# EAGLE schematic old MainBoard 1.8.0 (EAGLE 9.6.2)
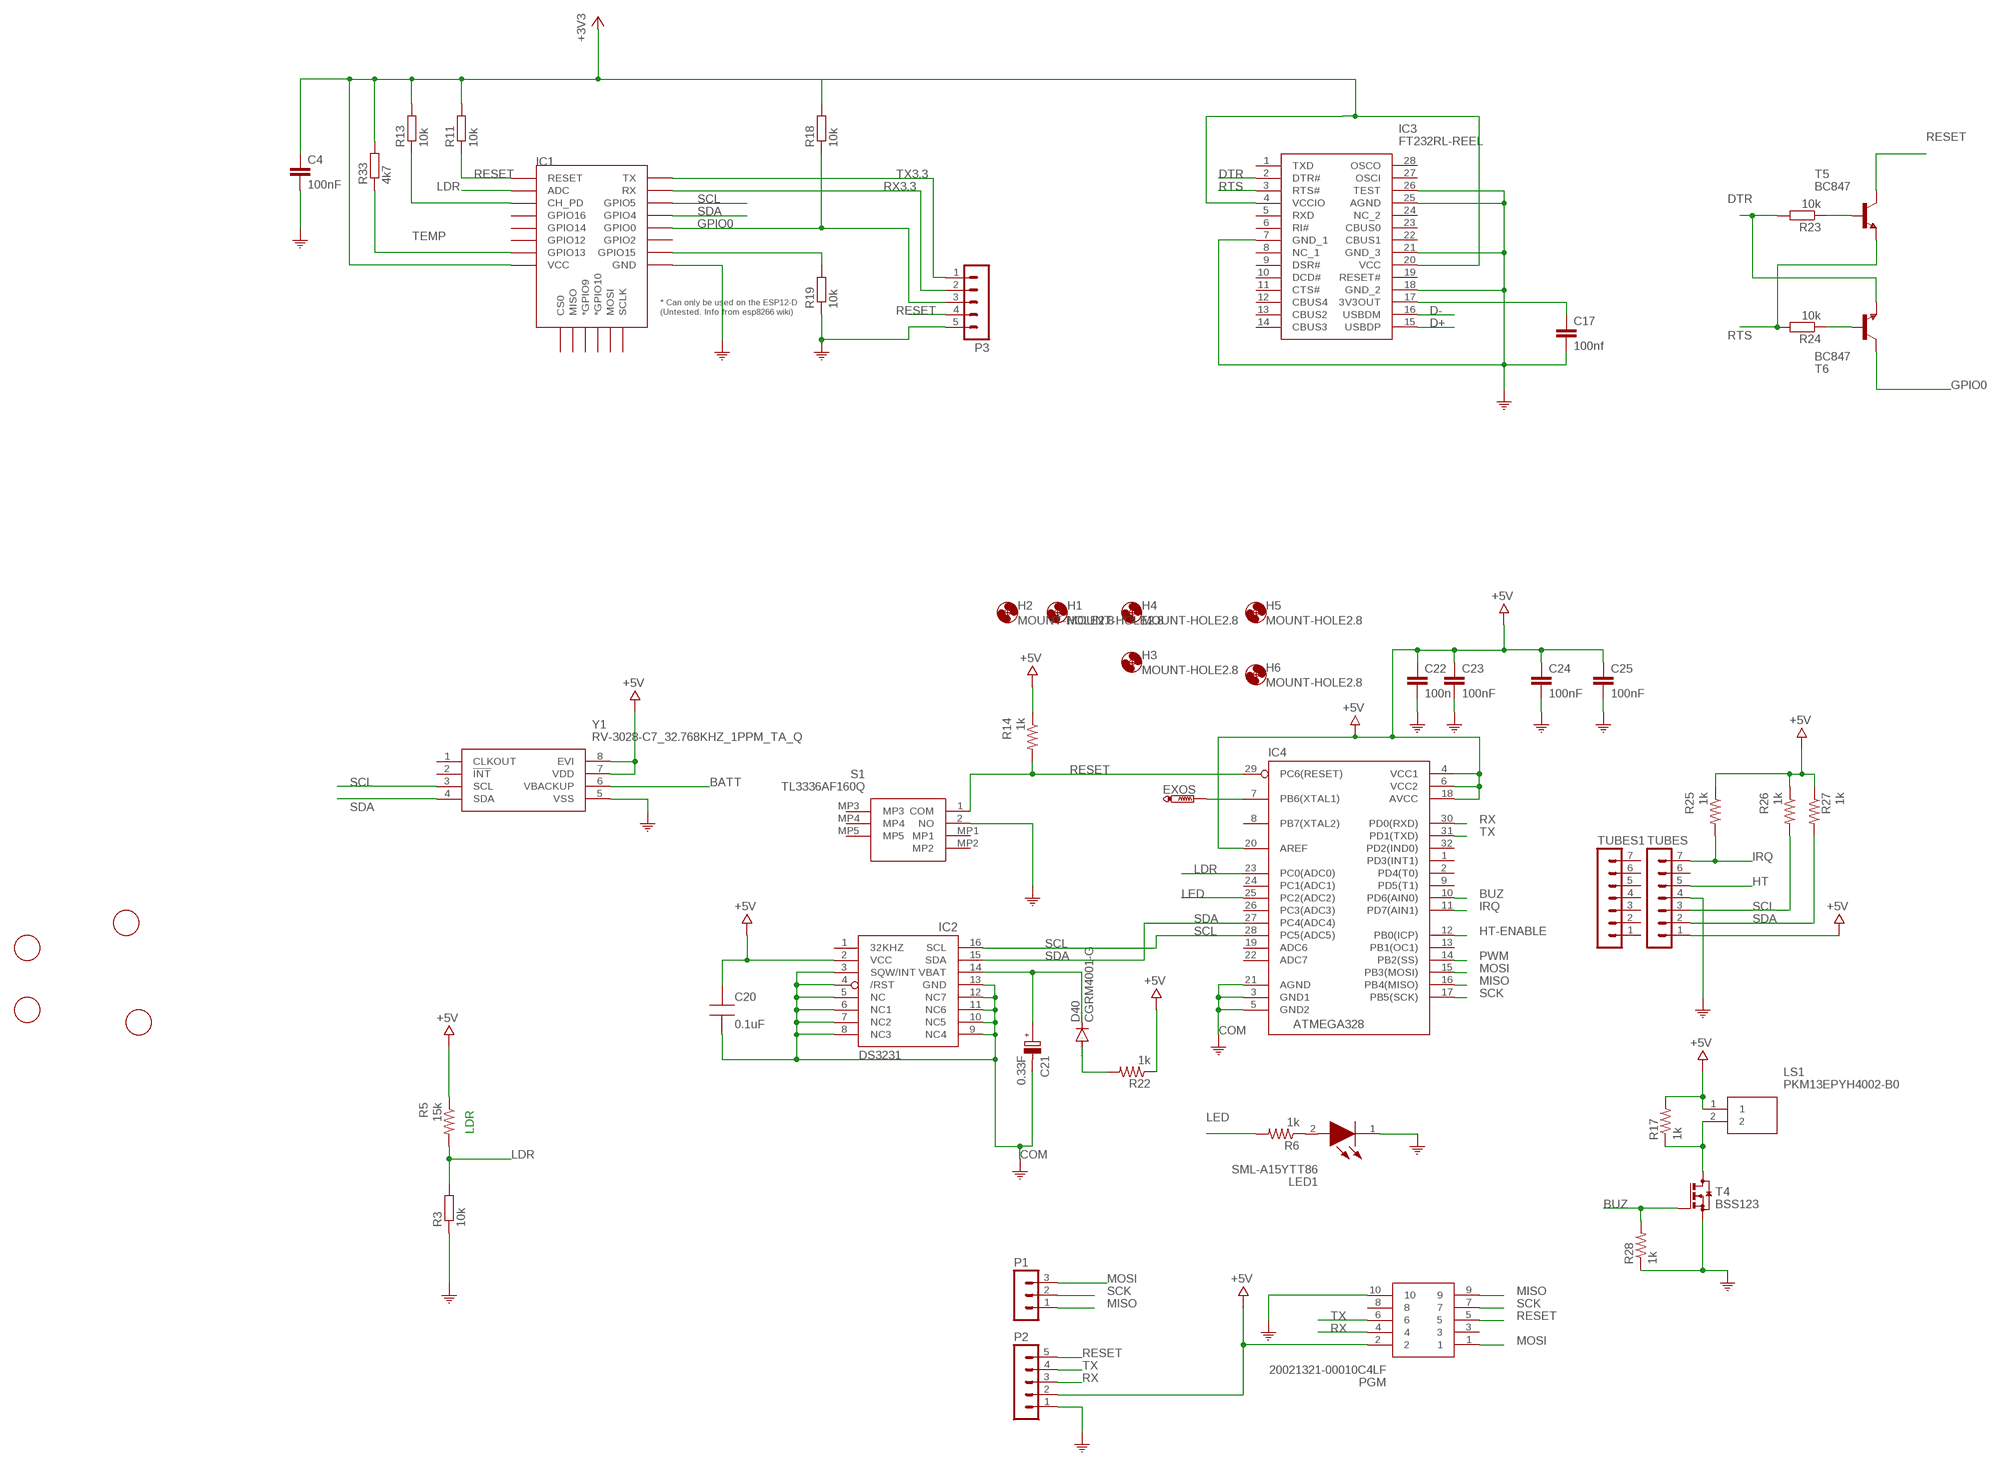
[diagram p0: schematic, sheet 1, part 1 of 2]
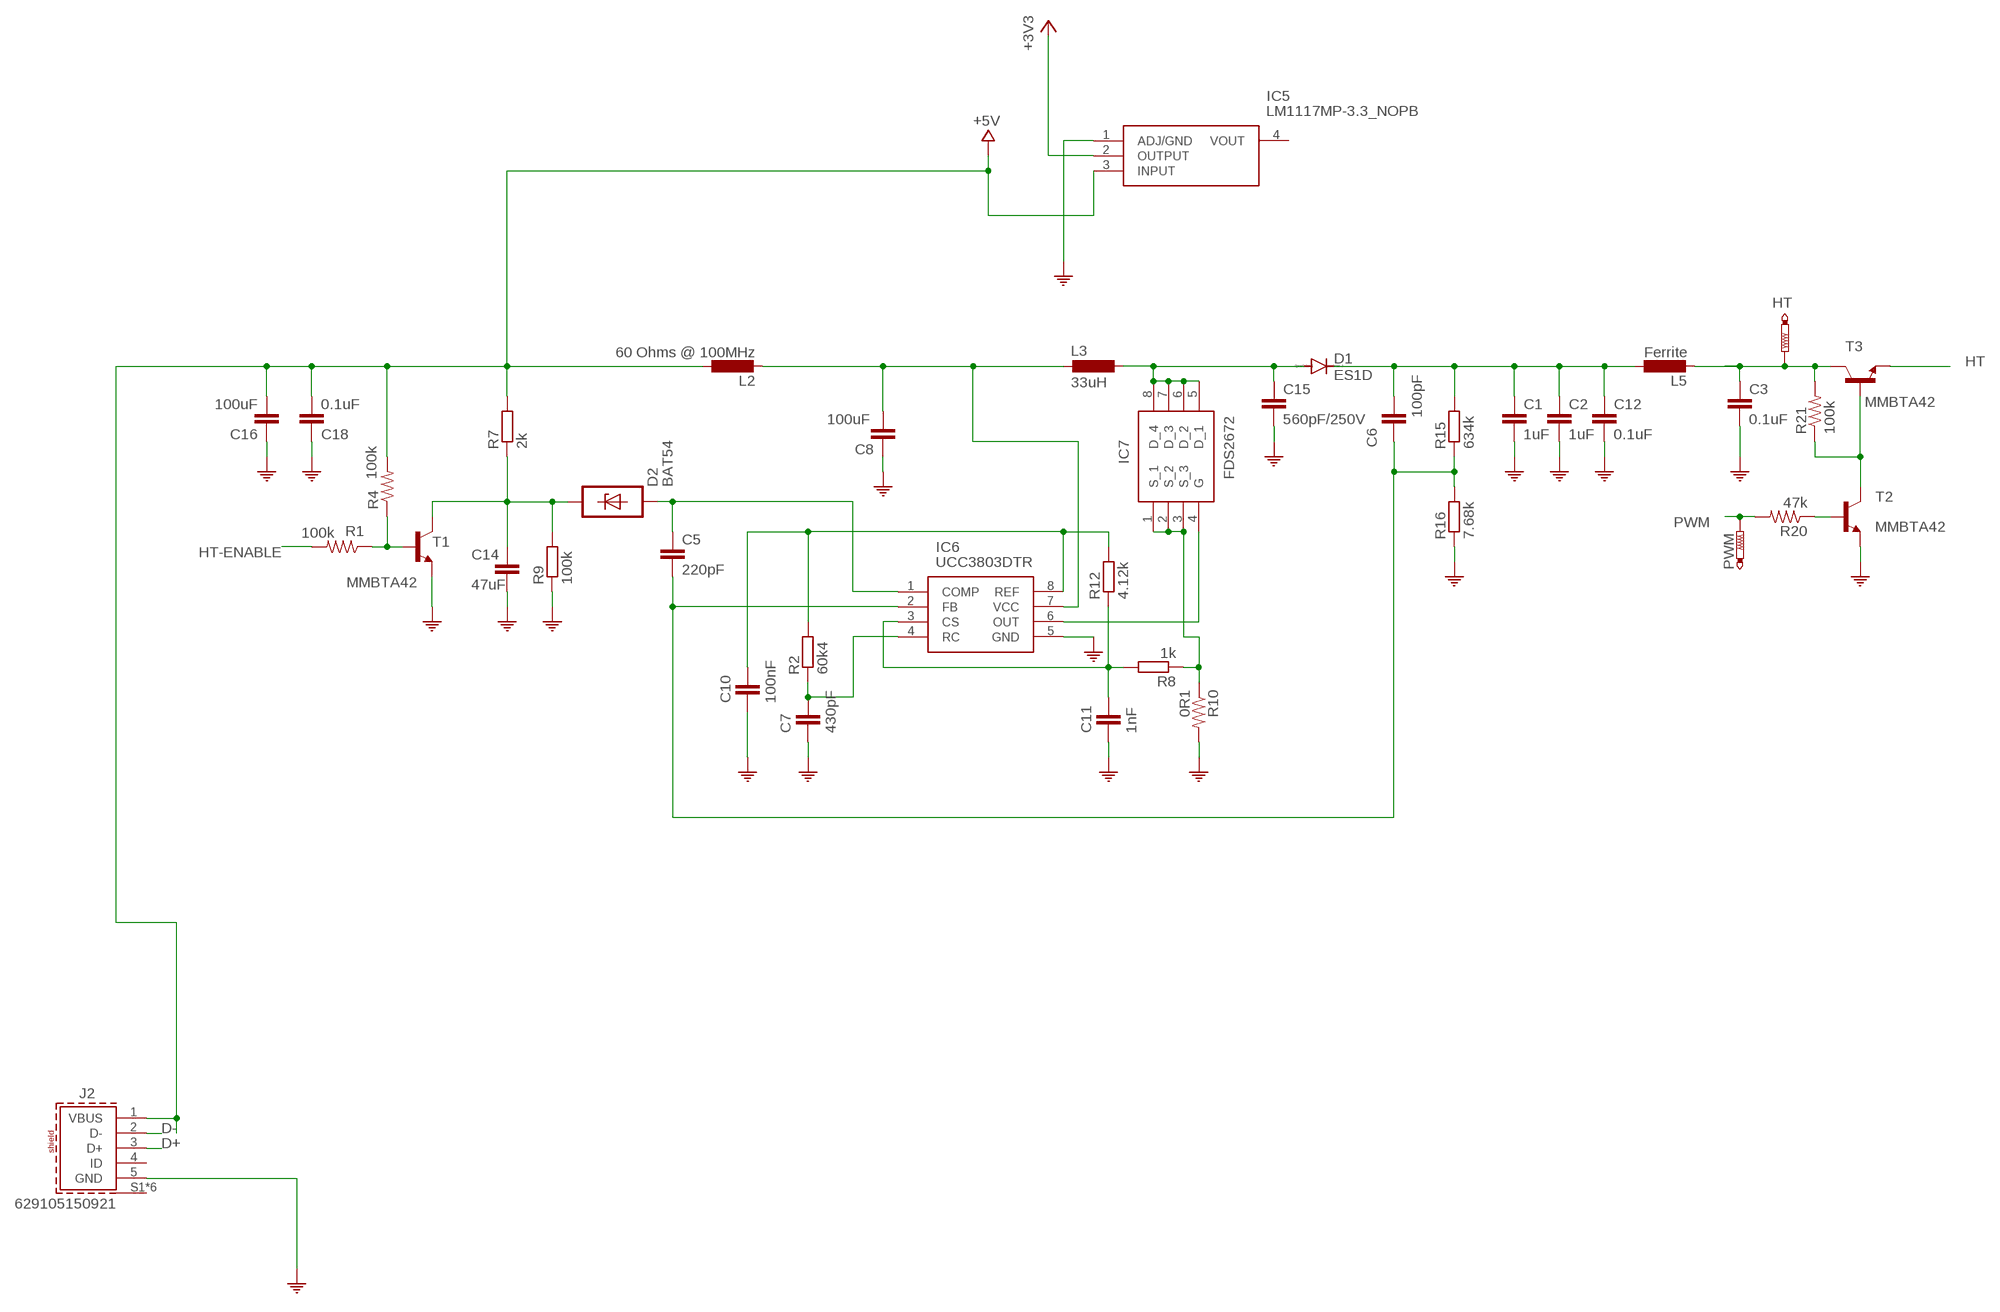
[diagram p1: schematic, sheet 1, part 2 of 2]

## Parts
C1  1uF  C-EUC1812K  [C1812K]
C2  1uF  C-EUC1812K  [C1812K]
C3  0.1uF  C-EUC1808  [C1808]
C4  100nF  C-EUC1812K  [C1812K]
C5  220pF  C-EUC0402  [C0402]
C6  100pF  C-EUC0805  [C0805]
C7  430pF  C-EUC0805  [C0805]
C8  100uF  C-EUC1210  [C1210]
C10  100nF  C-EUC0805  [C0805]
C11  1nF  C-EUC0805  [C0805]
C12  0.1uF  C-EUC1808  [C1808]
C14  47uF  C-EUC1210  [C1210]
C15  560pF/250V  C-EUC0603  [C0603]
C16  100uF  C-EUC1210  [C1210]
C17  100nf  C-EUC1206  [C1206]
C18  0.1uF  C-EUC0402  [C0402]
C20  0.1uF  CAP0805-NP  [CAP0805-NP]
C21  0.33F  AHG-35/100-RADIAL  [ELNA21.5X8.0]
C22  100n  C-EUC0805  [C0805]
C23  100nF  C-EUC0805  [C0805]
C24  100nF  C-EUC0805  [C0805]
C25  100nF  C-EUC0805  [C0805]
D1  ES1D  ES2D  [SMB]
D2  BAT54  SP4020-01FTG  [SOD323]
D40  CGRM4001-G  [SOD-123_MINI-SMA]
EXOS  PTR1TP09R  [TP09R]
H1  MOUNT-HOLE2.8  [2,8]
H2  MOUNT-HOLE2.8  [2,8]
H3  MOUNT-HOLE2.8  [2,8]
H4  MOUNT-HOLE2.8  [2,8]
H5  MOUNT-HOLE2.8  [2,8]
H6  MOUNT-HOLE2.8  [2,8]
HT  PTR1TP09R  [TP09R]
IC1  ESP12ESMD  [ESP12E-SMD]
IC2  DS3231/SO  [SO16W]
IC3  FT232RL-REEL  [SOP65P778X200-28N]
IC4  ATMEGA328  ATMEGA168-20AU  [QFP032]
IC5  LM1117MP-3.3_NOPB  [SOT230P700X180-4N]
IC6  UCC3803DTR  [SOIC127P600X175-8N]
IC7  FDS2672  [SOIC127P600X175-8N]
J2  629105150921  [629105150921]
L2  60 Ohms @ 100MHz  L-EUL2012C  [L2012C]
L3  33uH  MSS7341  [MSS7341]
L5  Ferrite  L-EUL2012C  [L2012C]
LED1  SML-A15YTT86  [SMLA15YTT86]
LS1  PKM13EPYH4002-B0  [PKM13EPYH4002-B0]
P1  MA03-1  [MA03-1]
P2  MA05-1  [MA05-1]
P3  MA05-1  [MA05-1]
PGM  20021321-00010C4LF  [2002132100010C4LF]
PWM  PTR1TP09R  [TP09R]
R1  100k  R-US_R0805  [R0805]
R2  60k4  R-EU_R0805  [R0805]
R3  10k  R-EU_0204/2V  [0204V]
R4  100k  R-US_R0805  [R0805]
R5  15k  R-US_M2012  [M2012]
R6  1k  R-US_M2012  [M2012]
R7  2k  R-EU_R0805  [R0805]
R8  1k  R-EU_R0805  [R0805]
R9  100k  R-EU_R0805  [R0805]
R10  0R1  R-US_R2010  [R2010]
R11  10k  R-EU_M0805  [M0805]
R12  4.12k  R-EU_R0805  [R0805]
R13  10k  R-EU_M0805  [M0805]
R14  1k  R-US_M2012  [M2012]
R15  634k  R-EU_R0805  [R0805]
R16  7.68k  R-EU_R0805  [R0805]
R17  1k  R-US_M2012  [M2012]
R18  10k  R-EU_M0805  [M0805]
R19  10k  R-EU_M0805  [M0805]
R20  47k  R-US_R0805  [R0805]
R21  100k  R-US_R0805  [R0805]
R22  1k  R-US_M2012  [M2012]
R23  10k  R-EU_M0805  [M0805]
R24  10k  R-EU_M0805  [M0805]
R25  1k  R-US_M2012  [M2012]
R26  1k  R-US_M2012  [M2012]
R27  1k  R-US_M2012  [M2012]
R28  1k  R-US_M2012  [M2012]
R33  4k7  R-EU_M0805  [M0805]
S1  TL3336AF160Q  [TL3336AF160Q]
T1  MMBTA42  BC846  [SOT23]
T2  MMBTA42  BC846  [SOT23]
T3  MMBTA42  BC846  [SOT23]
T4  BSS123  [SOT23]
T5  BC847  [SOT23]
T6  BC847  [SOT23]
TUBES  MA07-1  [MA07-1]
TUBES1  MA07-1  [MA07-1]
U$4  FIDUCIAL  [FIDUCIAL_1MM]
U$5  FIDUCIAL  [FIDUCIAL_1MM]
U$20  FIDUCIAL  [FIDUCIAL_1MM]
U$36  FIDUCIAL  [FIDUCIAL_1MM]
Y1  RV-3028-C7_32.768KHZ_1PPM_TA_Q  [RV3028C732768KHZ1PPMTAQC]

## Nets
+3V3: C4.1 IC1.VCC IC3.4(VCCIO) IC3.20(VCC) IC5.2(OUTPUT) R11.2 R13.2 R18.2 R33.2
+5V [pwr]: C16.2 C18.1 C20.1 C22.1 C23.1 C24.1 C25.1 IC2.2(VCC) IC4.4(VCC1) IC4.6(VCC2) IC4.18(AVCC) IC4.20(AREF) IC5.3(INPUT) J2.1(VBUS) L2.1 LS1.1 P2.2 PGM.2 R4.2 R5.1 R7.2 R14.1 R17.2 R22.1 R25.1 R26.1 R27.1 TUBES.1 Y1.7(VDD) Y1.8(EVI)
BATT: C21.+ D40.C IC2.14(VBAT) Y1.6(VBACKUP)
BUZ: IC4.10(PD6(AIN0)) R28.2 T4.1(G)
COM: C1.2 C2.2 C3.2 C4.2 C7.2 C8.1 C10.2 C11.2 C12.2 C14.2 C15.2 C16.1 C17.2 C18.2 C20.2 C21.- C22.2 C23.2 C24.2 C25.2 IC1.GND IC2.3(SQW/INT) IC2.4(/RST) IC2.5(NC) IC2.6(NC1) IC2.7(NC2) IC2.8(NC3) IC2.9(NC4) IC2.10(NC5) IC2.11(NC6) IC2.12(NC7) IC2.13(GND) IC3.7(GND_1) IC3.18(GND_2) IC3.21(GND_3) IC3.25(AGND) IC3.26(TEST) IC4.3(GND1) IC4.5(GND2) IC4.21(AGND) IC5.1(ADJ/GND) IC6.5(GND) J2.5(GND) LED1.1(K) P2.1 P3.5 PGM.10 R3.1 R9.1 R10.2 R16.1 R19.1 R28.1 S1.2(NO) T1.2(E) T2.2(E) T4.2(S) TUBES.4 Y1.5(VSS)
CS: C11.1 IC6.3(CS) R8.2 R12.1
D+: IC3.15(USBDP) J2.3(D+)
D-: IC3.16(USBDM) J2.2(D-)
DTR: IC3.2(DTR#) R23.2 T6.2(E)
FB: C5.2 C6.2 IC6.2(FB) R15.1 R16.2
GPIO0: IC1.GPIO0 P3.3 R18.1 T6.3(C)
HT: T3.2(E) TUBES.5
HT-ENABLE: IC4.12(PB0(ICP)) R1.2
IRQ: IC4.11(PD7(AIN1)) R25.2 TUBES.7
LDR: IC1.ADC IC4.23(PC0(ADC0)) R3.2 R5.2
LED: IC4.25(PC2(ADC2)) R6.2
MISO: IC4.16(PB4(MISO)) P1.1 PGM.9
MOSI: IC4.15(PB3(MOSI)) P1.3 PGM.1
N$1: LED1.2(A) R6.1
N$2: IC1.CH_PD R13.1
N$3: LS1.2 R17.1 T4.3(D)
N$5: EXOS.TP IC4.7(PB6(XTAL1))
N$6: C1.1 C2.1 C6.1 C12.1 D1.C L5.1 R15.2
N$7: R21.1 T2.3(C) T3.1(B)
N$8: R1.1 R4.1 T1.1(B)
N$9: C14.1 D2.C R7.1 R9.2 T1.3(C)
N$10: C5.1 D2.A IC6.1(COMP)
N$11: IC1.GPIO15 R19.2
N$12: IC7.1(S_1) IC7.2(S_2) IC7.3(S_3) R8.1 R10.1
N$13: R23.1 T5.1(B)
N$14: C8.2 IC6.7(VCC) L2.2 L3.1
N$15: R24.1 T6.1(B)
N$16: C17.1 IC3.17(3V3OUT)
N$18: C15.1 D1.A IC7.5(D_1) IC7.6(D_2) IC7.7(D_3) IC7.8(D_4) L3.2
N$19: R20.1 T2.1(B)
N$23: D40.A R22.2
OUT: IC6.6(OUT) IC7.4(G)
PWM: IC4.14(PB2(SS)) PWM.TP R20.2
RAW_HT: C3.1 HT.TP L5.2 R21.2 T3.3(C)
RC: C7.1 IC6.4(RC) R2.1
REF: C10.1 IC6.8(REF) R2.2 R12.2
RESET: IC1.RESET IC4.29(PC6(RESET)) P2.5 P3.4 PGM.5 R11.1 R14.2 S1.1(COM) T5.3(C)
RTS: IC3.3(RTS#) R24.2 T5.2(E)
RX: IC4.30(PD0(RXD)) P2.3 PGM.4
RX3.3: IC1.RXD0(RX) P3.2
SCK: IC4.17(PB5(SCK)) P1.2 PGM.7
SCL: IC1.GPIO5 IC2.16(SCL) IC4.28(PC5(ADC5)) R26.2 TUBES.3 Y1.3(SCL)
SDA: IC1.GPIO4 IC2.15(SDA) IC4.27(PC4(ADC4)) R27.2 TUBES.2 Y1.4(SDA)
TEMP: IC1.GPIO13 R33.1
TX: IC4.31(PD1(TXD)) P2.4 PGM.6
TX3.3: IC1.TXD0(TX) P3.1
Unconnected: IC1.CS0 IC1.GPIO2 IC1.GPIO9(*GPIO9) IC1.GPIO10(*GPIO10) IC1.GPIO12 IC1.GPIO14 IC1.GPIO16 IC1.MISO IC1.MOSI IC1.SCLK IC2.1(32KHZ) IC3.1(TXD) IC3.5(RXD) IC3.6(RI#) IC3.8(NC_1) IC3.9(DSR#) IC3.10(DCD#) IC3.11(CTS#) IC3.12(CBUS4) IC3.13(CBUS2) IC3.14(CBUS3) IC3.19(RESET#) IC3.22(CBUS1) IC3.23(CBUS0) IC3.24(NC_2) IC3.27(OSCI) IC3.28(OSCO) IC4.1(PD3(INT1)) IC4.2(PD4(T0)) IC4.8(PB7(XTAL2)) IC4.9(PD5(T1)) IC4.13(PB1(OC1)) IC4.19(ADC6) IC4.22(ADC7) IC4.24(PC1(ADC1)) IC4.26(PC3(ADC3)) IC4.32(PD2(IND0)) IC5.4(VOUT) J2.4(ID) J2.S1(SHIELD) J2.S2(SHIELD) J2.S3(SHIELD) J2.S4(SHIELD) J2.S5(SHIELD) J2.S6(SHIELD) PGM.3 PGM.8 S1.MP1 S1.MP2 S1.MP3 S1.MP4 S1.MP5 TUBES1.1 TUBES1.2 TUBES1.3 TUBES1.4 TUBES1.5 TUBES1.6 TUBES1.7 TUBES.6 Y1.1(CLKOUT) Y1.2(!INT)

## Notes on the sheet
- LDR

## Library data of the parts
C1 C2 = rcl:C-EU: CAPACITOR, European symbol; MOUSER: 810-CGA8P3X7T2E105MA; PU: 1.07; SPICEPREFIX: C; TDK: C4532X7T2E105M250KE
C3 C12 = rcl:C-EU: CAPACITOR, European symbol; MOUSER: 581-1808PC104KAT1A; PU: 0.88; SPICEPREFIX: C
C4 C17 = resistor:C-EU: CAPACITOR, European symbol
C5 = rcl:C-EU: CAPACITOR, European symbol; MOUSER: 963-LMK042B7221KC-W; SPICEPREFIX: C
C6 = rcl:C-EU: CAPACITOR, European symbol; MOUSER: 81-GCM21A5C2E101JX1D; PU: 0.319; SPICEPREFIX: C
C7 = rcl:C-EU: CAPACITOR, European symbol; MOUSER: 581-08055A431JAT4A; PU: 0.23; SPICEPREFIX: C
C8 C16 = rcl:C-EU: CAPACITOR, European symbol; MOUSER: 963-EMK325ABJ107MM-P; SPICEPREFIX: C; TAIYO_YUDEN: EMK325ABJ107MM-P
C10 = rcl:C-EU: CAPACITOR, European symbol; MOUSER: 963-EMF212B7104KGHT; PU: 0.23; SPICEPREFIX: C
C11 = rcl:C-EU: CAPACITOR, European symbol; MOUSER: 710-885382207004; PU: 0.122; SPICEPREFIX: C
C14 = rcl:C-EU: CAPACITOR, European symbol; MOUSER: 963-EMK325BJ476MM-P; SPICEPREFIX: C
C15 = rcl:C-EU: CAPACITOR, European symbol; MOUSER: 80-C0603C561JAG; PU: 0.038; SPICEPREFIX: C
C18 = rcl:C-EU: CAPACITOR, European symbol; MOUSER: 963-LMF105B7104KVHF; PU: 0.676; SPICEPREFIX: C
C20 = MySMD:CAP0805-NP
C21 = Elkos:AHG-35/100-RADIAL: AUDYN® - AHG Gepolt, radial High Grade AHG Gepolter Elekrolytkondensator für Audio-Netzteile, oder Verstärker im Home- und Car-Bereich. Technische Daten Anschlußdrähte: Kupfer, verzinnt AL: ? mm d2ø : ? mm Kapazitätsbereich: von 10 µF bis 2200 µF Nennspannungen: 25 V, 35 V, 50 V, 100 V C-Toleranz: 20 % ( bei 20° C ) Verlustfaktor: tan δ < 0,100 @ 1 kHz Temperaturbereich: - 40° C bis 85° C Verzerrung: sehr gering bei 10 kHz, 010 A - 120 dB oder niedriger gepolt AHG AUDYN® - AHG gepolt Bezeichnung C U DxH Rm Bestell.-Nr. U / Volt D x L/mm mm AHG/10.0/100V 10µF 100V 10x15 5,0 1341690 AHG/22.0/50V 22µF 50V 10x13 5,0 1341691 AHG/47.0/50V 47µF 50V 10x16 5,0 1341692 AHG/100.0/50V 100µF 50V 13x21 5,0 1341693 AHG/220.0/50V 220µF 50V 16x25 7,5 1341694 AHG/470.0/50V 470µF 50V 16x37 7,5 1341695 AHG/1000/35V 1000µF 35V 18x37 7,5 1341696 AHG/2200/35V 2200µF 35V 22x38 10,0 1341697 Alle Abmessungen in mm; MOUSER: 555-DBN-5R5D334T; PU: 2.46
C22-C25 = rcl:C-EU: CAPACITOR, European symbol; SPICEPREFIX: C
D1 = diode:ES2D: DIODE super fast rectifier, 2 A; MOUSER: 512-ES1DF
D2 = sp4020_11:SP4020-01FTG: SP4020 Series 2.5pF, 30A Discrete TVS Diode Source: http://www.littelfuse.com/~/media/electronics/datasheets/tvs_diode_arrays/littelfuse_tvs_diode_array_sp4020_datasheet.pdf.pdf; MF: Littelfuse; MOUSER: 621-BAT54WS-F; MPN: SP4020-01FTG; OC_FARNELL: unknown; OC_NEWARK: 05X0400
D40 = diode:CGRM400*-G: Molded plasitc,JEDEC SOD-123/Mini SMA Source: Comchip CGRM4001-G.pdf; MOUSER: 863-NSR0320MW2T1G; PU: 0.22
EXOS HT PWM = testpad:PTR1: TEST PIN
H1-H6 = holes:MOUNT-HOLE: MOUNTING HOLE with drill center marker
IC1 = esp8266modules:ESP12E: ESP12E Module
IC2 = DS3231:DS3231; AVAILABILITY: Unavailable; MF: Maxim Integrated; MOUSER: 700-DS3231SN#; MP: DS3231; PACKAGE: SOIC-16 Maxim Integrated; PRICE: None; PU: 9.50
IC3 = SamacSys_Parts:FT232RL-REEL: USB/Serial IC UART SSOP-28 FTDI Chip FT232RL-REEL, USB Controller, 3MBd, USB 2.0, 1.8 5.25 V, 28-Pin SSOP Source: Datasheet <http://www.ftdichip.com/Support/Documents/DataSheets/ICs/DS_FT232R.pdf>; DESCRIPTION: USB/Serial IC UART SSOP-28 FTDI Chip FT232RL-REEL, USB Controller, 3MBd, USB 2.0, 1.8 5.25 V, 28-Pin SSOP; HEIGHT: 2mm; MANUFACTURER_NAME: FTDI Chip; MANUFACTURER_PART_NUMBER: FT232RL-REEL; MOUSER_PART_NUMBER: 895-FT232RL; MOUSER_PRICE-STOCK: https://www.mouser.co.uk/ProductDetail/FTDI/FT232RL-REEL?qs=D1%2FPMqvA103RC6OU6bKtoA%3D%3D
IC4 = MySMD:ATMEGA168-20AU; PU: 1.40
IC5 = SamacSys_Parts:LM1117MP-3.3_NOPB: Space saving 800-mA low-dropout linear regulator with internal current limit Source: Datasheet <http://www.ti.com/general/docs/suppproductinfo.tsp?distId=10&gotoUrl=http://www.ti.com/lit/gpn/lm1117>; DESCRIPTION: Space saving 800-mA low-dropout linear regulator with internal current limit; HEIGHT: 1.8mm; MANUFACTURER_NAME: Texas Instruments; MANUFACTURER_PART_NUMBER: LM1117MP-3.3/NOPB; MOUSER_PART_NUMBER: 926-LM1117MP-3.3NOPB; MOUSER_PRICE-STOCK: https://www.mouser.co.uk/ProductDetail/Texas-Instruments/LM1117MP-33-NOPB?qs=X1J7HmVL2ZFn4x9DZ4T2hA%3D%3D
IC6 = UCC3803DTR:UCC3803DTR: Switching Controllers Low-Power BiCMOS Current-Mode PWM Source: Datasheet <http://www.ti.com/lit/ds/symlink/ucc3803.pdf>; DESCRIPTION: Switching Controllers Low-Power BiCMOS Current-Mode PWM; HEIGHT: 1.75mm; MANUFACTURER_NAME: Texas Instruments; MANUFACTURER_PART_NUMBER: UCC3803DTR; MOUSER: 595-UCC3803D; MOUSER_PART_NUMBER: 595-UCC3803DTR; MOUSER_PRICE-STOCK: https://www.mouser.com/Search/Refine.aspx?Keyword=595-UCC3803DTR; PU: 3.05
IC7 = FDS2672:FDS2672: FDS2672, N-channel MOSFET Transistor 3.9 A 200 V, 8-Pin SOIC Source: Datasheet <http://docs-emea.rs-online.com/webdocs/0d23/0900766b80d23481.pdf>; DESCRIPTION: FDS2672, N-channel MOSFET Transistor 3.9 A 200 V, 8-Pin SOIC; HEIGHT: 1.75mm; MANUFACTURER_NAME: Fairchild Semiconductor; MANUFACTURER_PART_NUMBER: FDS2672; MOUSER: 512-FDS2672; MOUSER_PART_NUMBER: 512-FDS2672; MOUSER_PRICE-STOCK: https://www.mouser.com/Search/Refine.aspx?Keyword=512-FDS2672; PU: 1.54; RS_PART_NUMBER: 6710481P; RS_PRICE-STOCK: http://uk.rs-online.com/web/p/products/6710481P
J2 = Wurth_Connectors_WR-USB:629105150921: WR-COM Micro USB 2.0 Type AB Horizontal Kind Properties Durability:10 000 Mating cycles Connector Type:Micro USB Gender:Receptacle Type:Horizontal General Information Operating Temperature:-40up to +85 °C Electrical Properties Working Voltage:30V (AC) Withstanding Voltage:100V (AC) Contact Resistance:30 mΩ Material Properties Insulator Material:LCP Insulator Flammability Rating:UL94 V-0 Color:Black Contact Material:Copper Alloy Contact Plating: Gold Contact Type:Stamped Shielding Material:Stainless Steel Shielding Plating:Matte Tin <https://www.we-online.com/catalog/media/o33046v209%20Family_WR-COM_Micro_USB_629105150921.jpg> Details see: https://www.we-online.com/catalog/en/COM_MICRO_2_0_TYPE_AB_HORIZONTAL/ Updated by Ella Wu 2021-03-09 2021 (C) Würth Elektronik; APPLICATION: Micro USB 2.0; DATASHEET-URL: https://www.we-online.com/catalog/datasheet/629105150921.pdf; GERDER: Receptacle; INTERFACE-TYPE: Type AB; IR1: 1.8A; MOUNT: SMT; MOUSER: 710-629105150921; PACKAGING: Tape and Reel; PART-NUMBER: 629105150921; PINS: 5; PU: 1.90; TYPE: Horizontal; WORKING-VOLTAGE: 30V(AC)
L2 L5 = rcl:L-EU: INDUCTOR, European symbol; MOUSER: 963-BKP2125HS600-T; SPICEPREFIX: L
L3 = STEAM-inductor-coilcraft:MSS7341: Shielded Power Inductors Package 6.6 × 6.6 mm x 4.1 mm high Source: http://www.farnell.com/datasheets/1681958.pdf; MOUSER: 710-784770330; PU: 2.55
LED1 = SamacSys_Parts:SML-A15YTT86: Yellow 590nm LED Indication - Discrete 2.1V 2-SMD, No Lead Source: Datasheet <https://fscdn.rohm.com/en/products/databook/datasheet/opto/led/chip_mono/sml-a15x-e.pdf>; DESCRIPTION: Yellow 590nm LED Indication - Discrete 2.1V 2-SMD, No Lead; HEIGHT: 0.65mm; MANUFACTURER_NAME: ROHM Semiconductor; MANUFACTURER_PART_NUMBER: SML-A15YTT86; MOUSER: 755-SML-A15YTT86; PU: 0.25
LS1 = SamacSys_Parts:PKM13EPYH4002-B0: Transducer piezo PCB 30Vpp 70dB 12.6mm Murata Buzzer Source: Datasheet <http://www.murata.com/~/media/webrenewal/support/library/catalog/products/sound/p37e.ashx>; DESCRIPTION: Transducer piezo PCB 30Vpp 70dB 12.6mm Murata Buzzer; HEIGHT: mm; MANUFACTURER_NAME: Murata Electronics; MANUFACTURER_PART_NUMBER: PKM13EPYH4002-B0; MOUSER_PART_NUMBER: 81-PKM13EPYH4002-B0; MOUSER_PRICE-STOCK: https://www.mouser.co.uk/ProductDetail/Murata-Electronics/PKM13EPYH4002-B0?qs=flZjIlU0hx09jX8FupUNIw%3D%3D
P1 = con-lstb:MA03-1: PIN HEADER; OC_FARNELL: unknown; OC_NEWARK: unknown
P2 P3 = con-lstb:MA05-1: PIN HEADER; OC_FARNELL: unknown; OC_NEWARK: unknown
PGM = SamacSys_Parts:20021321-00010C4LF: Headers & Wire Housings 1.27x1.27mm BTB, Hdr Recept, SMT, 10 Pos Source: Datasheet <https://componentsearchengine.com/Datasheets/1/20021321-00010C4LF.pdf>; DESCRIPTION: Headers & Wire Housings 1.27x1.27mm BTB, Hdr Recept, SMT, 10 Pos; HEIGHT: 4.75mm; MANUFACTURER_NAME: Amphenol; MANUFACTURER_PART_NUMBER: 20021321-00010C4LF; MOUSER_PART_NUMBER: 649-202132100010C4LF; MOUSER_PRICE-STOCK: https://www.mouser.com/Search/Refine.aspx?Keyword=649-202132100010C4LF
R1 R4-R6 R14 R17 R20-R22 R25-R28 = adafruit:R-US_: RESISTOR, American symbol
R2 = rcl:R-EU_: RESISTOR, European symbol; MOUSER: 603-RT0805FRE0760K4L; PU: 0.11; SPICEPREFIX: R
R3 R8 R9 = rcl:R-EU_: RESISTOR, European symbol; SPICEPREFIX: R
R7 = rcl:R-EU_: RESISTOR, European symbol; MOUSER: 754-RR1220P-202D; SPICEPREFIX: R; SUSUMU: RR1220P-202-D
R10 = adafruit:R-US_: RESISTOR, American symbol; MOUSER: 603-PE2010FKE070R1L; PU: 0.7
R11 R13 R18 R19 R23 R24 R33 = resistor:R-EU_: RESISTOR, European symbol
R12 = rcl:R-EU_: RESISTOR, European symbol; KOASPEER: RN732ATTD4121F100; MOUSER: 660-RN732ATD4121F100; SPICEPREFIX: R
R15 = rcl:R-EU_: RESISTOR, European symbol; MOUSER: 71-CRCW0603-634K-E3; SPICEPREFIX: R; VISHAY: CRCW0603634KFKEA
R16 = rcl:R-EU_: RESISTOR, European symbol; MOUSER: 71-CRCW0805-7.68K-E3; PU: 0.09; SPICEPREFIX: R; VISHAY: CRCW08057K68FKEA
S1 = SamacSys_Parts:TL3336AF160Q: Tactile Switches Tactile Switch SPST OFF-(ON) 50mA, 12VDC, Right Angle SMT Source: Datasheet <http://spec_sheets.e-switch.com/specs/P158001.pdf>; DESCRIPTION: Tactile Switches Tactile Switch SPST OFF-(ON) 50mA, 12VDC, Right Angle SMT; HEIGHT: 7.35mm; MANUFACTURER_NAME: E-Switch; MANUFACTURER_PART_NUMBER: TL3336AF160Q; MOUSER_PART_NUMBER: 612-TL3336AF160Q; MOUSER_PRICE-STOCK: https://www.mouser.co.uk/ProductDetail/E-Switch/TL3336AF160Q?qs=iLbezkQI%252Bshf0NMs3%252BGhxA%3D%3D
T1-T3 = transistor:BC846: NPN TRANSISTOR
T4 = transistor-small-signal:BSS123: N-CHANNEL MOS FET; MOUSER: 726-BSS123NH6433; PU: 0.37
T5 T6 = transistor-neu-to92:BC847: NPN TRANSISTOR
TUBES TUBES1 = con-lstb:MA07-1: PIN HEADER; OC_FARNELL: unknown; OC_NEWARK: unknown
U$4 U$5 U$20 U$36 = adafruit:FIDUCIAL: For use by pick and place machines to calibrate the vision/machine, 1mm By microbuilder.eu
Y1 = SamacSys_Parts:RV-3028-C7_32.768KHZ_1PPM_TA_Q: Real Time Clock 32.768kHz I2C Time Acc. 1ppm Source: Datasheet <https://www.microcrystal.com/fileadmin/Media/Products/RTC/Datasheet/RV-3028-C7.pdf>; DESCRIPTION: Real Time Clock 32.768kHz I2C Time Acc. 1ppm; HEIGHT: 0.8mm; MANUFACTURER_NAME: Micro Crystal AG; MANUFACTURER_PART_NUMBER: RV-3028-C7 32.768kHz 1ppm TA QC; MOUSER_PART_NUMBER: 428-203591-MG01; MOUSER_PRICE-STOCK: https://www.mouser.co.uk/ProductDetail/Micro-Crystal/RV-3028-C7-32768kHz-1ppm-TA-QC?qs=u16ybLDytRaU7ZFJl2AxfQ%3D%3D

## Module TUBEIN16
Ports: 

### Library data of the parts

## Net classes
0 default: width 0.254 mm, clearance 0.254 mm
1 pwr: width 0.254 mm, clearance 0.356 mm